# EAGLE schematic SchematicV1 (EAGLE 6.0)
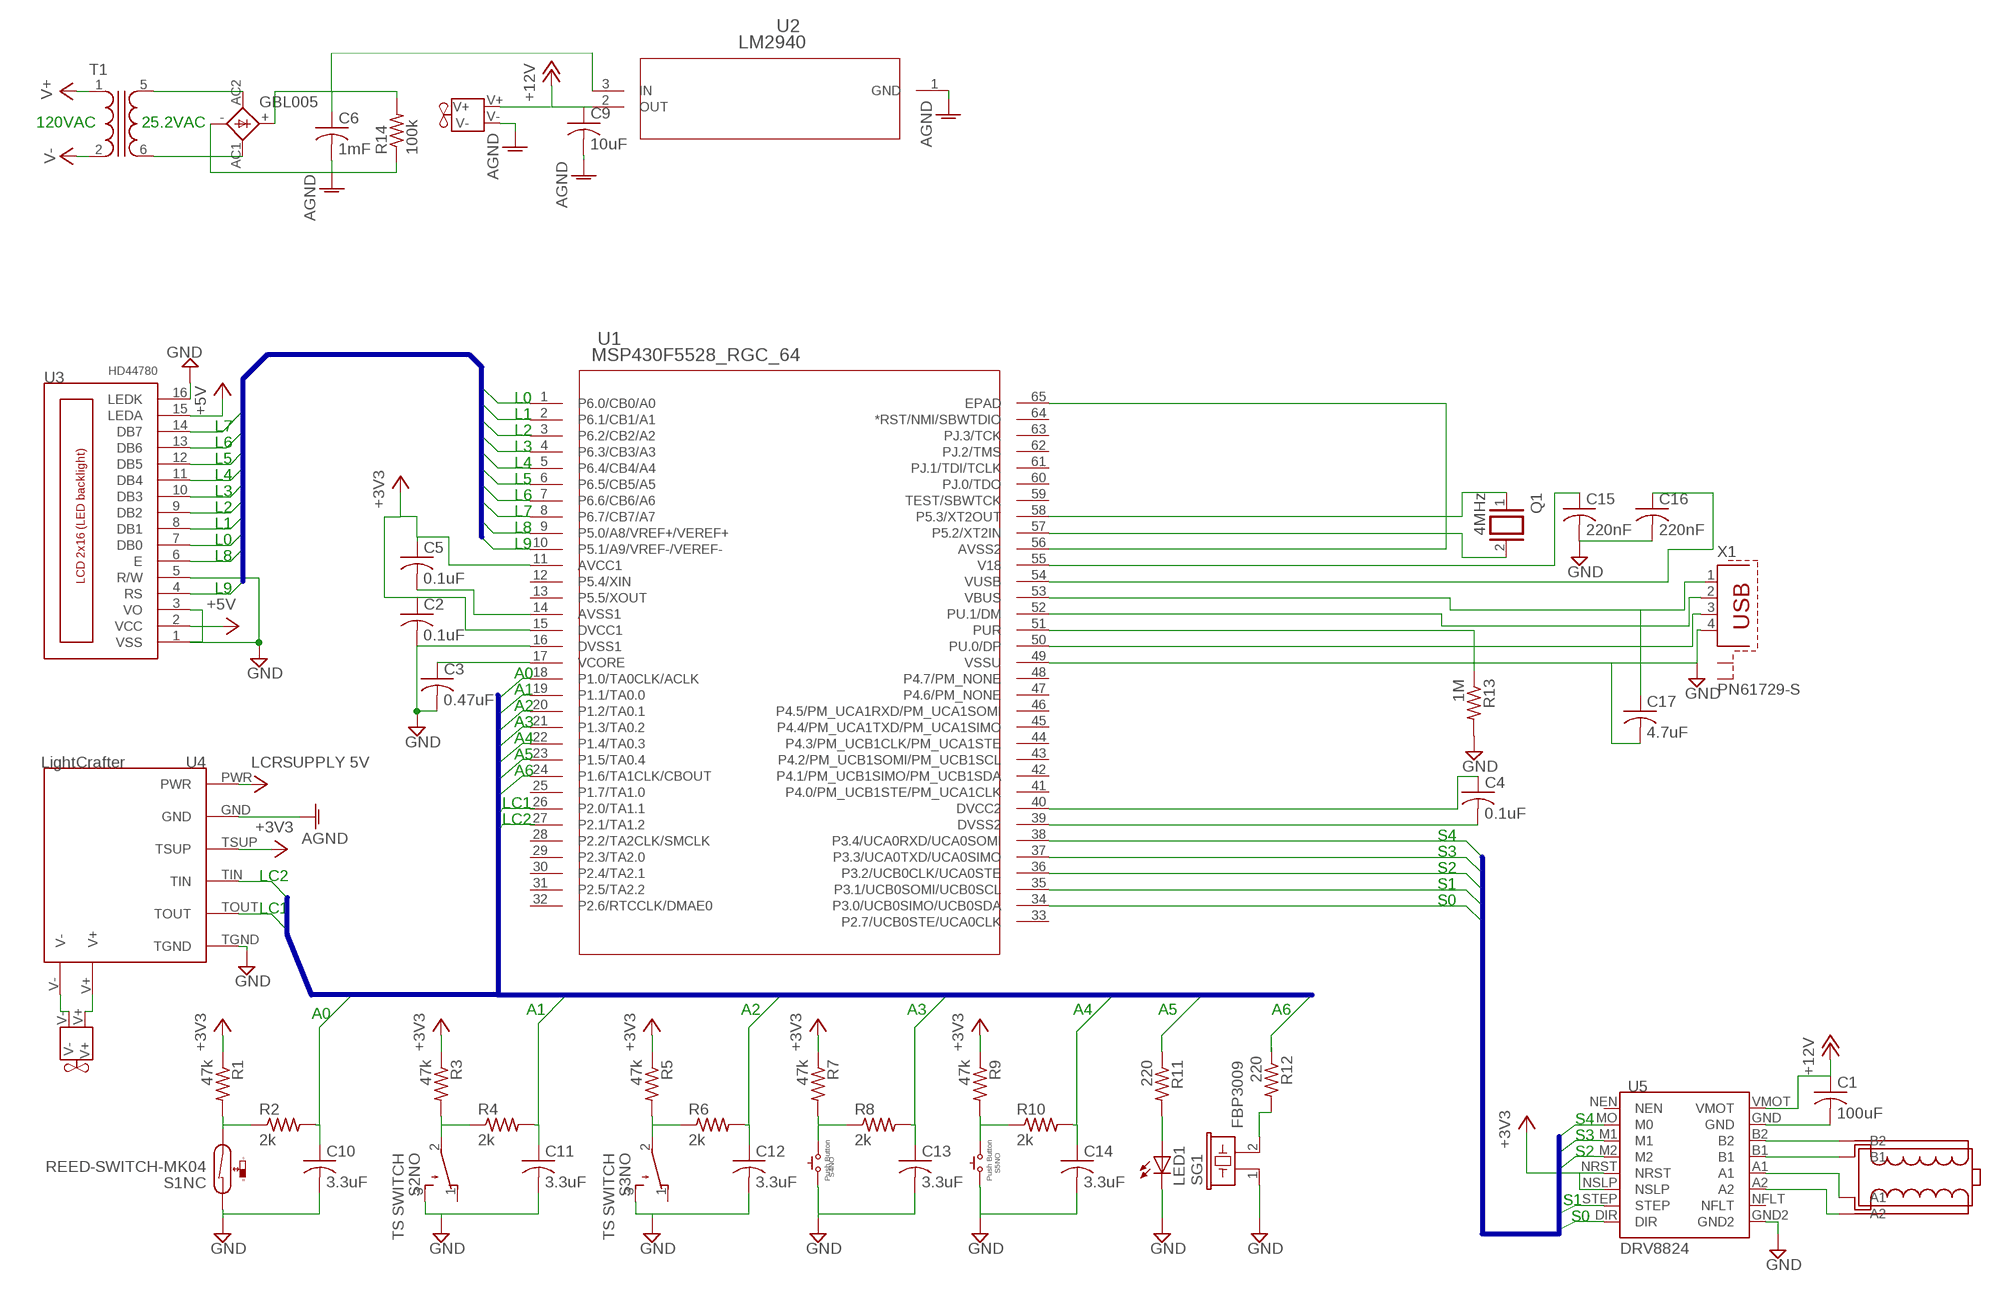
[diagram p0: schematic, sheet 1]

## Parts
C1  100uF  C-US075-032X103  [C075-032X103]
C2  0.1uF  C-US075-032X103  [C075-032X103]
C3  0.47uF  C-US075-032X103  [C075-032X103]
C4  0.1uF  C-US075-032X103  [C075-032X103]
C5  0.1uF  C-US075-032X103  [C075-032X103]
C6  1mF  C-US075-032X103  [C075-032X103]
C9  10uF  C-US075-032X103  [C075-032X103]
C10  3.3uF  C-US075-032X103  [C075-032X103]
C11  3.3uF  C-US075-032X103  [C075-032X103]
C12  3.3uF  C-US075-032X103  [C075-032X103]
C13  3.3uF  C-US075-032X103  [C075-032X103]
C14  3.3uF  C-US075-032X103  [C075-032X103]
C15  220nF  C-US075-032X103  [C075-032X103]
C16  220nF  C-US075-032X103  [C075-032X103]
C17  4.7uF  C-US075-032X103  [C075-032X103]
GBL005  GBU4  [GBU4S]
HD44780  LCD_2X16_SIL  [HY-1602F]
LED1  LEDB155  [Q62902-B155]
Q1  4MHz  XTAL/S  [QS]
R1  47k  R-US_0207/10  [0207/10]
R2  2k  R-US_0207/10  [0207/10]
R3  47k  R-US_0207/10  [0207/10]
R4  2k  R-US_0207/10  [0207/10]
R5  47k  R-US_0207/10  [0207/10]
R6  2k  R-US_0207/10  [0207/10]
R7  47k  R-US_0207/10  [0207/10]
R8  2k  R-US_0207/10  [0207/10]
R9  47k  R-US_0207/10  [0207/10]
R10  2k  R-US_0207/10  [0207/10]
R11  220  R-US_0207/10  [0207/10]
R12  220  R-US_0207/10  [0207/10]
R13  1M  R-US_0207/10  [0207/10]
R14  100k  R-US_0207/10  [0207/10]
S1NC  REED-SWITCH-MK04  REED-SWITCH-MK6-4  [MK6-4]
S2NO  TS SWITCH  TL32PO  [TL3XPO]
S3NO  TS SWITCH  TL32PO  [TL3XPO]
S4NO  PUSHBUTTON  [PUSHBUTTON]
S4NO1  PUSHBUTTON  [PUSHBUTTON]
SG1  FBP3009  B/C17S  [B/C17S]
T1  XFORMER  [T70-E]
U1  MSP430F5528_RGC_64  [RGC64_4P25X4P25]
U2  LM2940  LM1085_NDE_3  [T03B]
U3  DRV8824  [BO]
U$1  FAN  [FAN]
U$2  STEPPERMOTOR  [STEPPERMOTOR]
U$3  LIGHTCRAFTER  [LIGHTCRAFTER]
U$4  FAN  [FAN]
X1  PN61729-S  [PN61729-S]

## Nets
+3V3: C2.1 C5.1 R1.1 R3.1 R5.1 R7.1 R9.1 U1.11(AVCC1) U1.15(DVCC1) U$3.TSUP
+5V: HD44780.2(VCC) HD44780.15(LEDA)
+12V: C1.1 C9.1 U2.2(OUT) U3.VMOT
AGND: C6.2 C9.2 GBL005.- U2.1(GND) U$3.GND U$4.V-
GND: C2.2 C3.2 C10.2 C11.2 C12.2 C13.2 C14.2 C15.2 C16.2 C17.2 HD44780.1(VSS) HD44780.3(VO) HD44780.5(R/W) HD44780.16(LEDK) LED1.K(C) R13.2 S1NC.1 S2NO.3(S) S3NO.3(S) SG1.1 U1.16(DVSS1) U1.49(VSSU) U3.GND2 U$3.TGND X1.4
N$1: C1.2 U3.GND
N$2: U1.10(P5.1/A9/VREF-/VEREF-)
N$3: U1.9(P5.0/A8/VREF+/VEREF+)
N$4: C3.1 U1.17(VCORE)
N$5: C5.2 U1.14(AVSS1)
N$6: C4.1 U1.40(DVCC2)
N$7: U1.8(P6.7/CB7/A7)
N$8: U1.56(AVSS2) U1.65(EPAD)
N$9: C4.2 U1.39(DVSS2)
N$10: U1.38(P3.4/UCA0RXD/UCA0SOMI)
N$11: U1.37(P3.3/UCA0TXD/UCA0SIMO)
N$12: U1.36(P3.2/UCB0CLK/UCA0STE)
N$13: U1.35(P3.1/UCB0SOMI/UCB0SCL)
N$14: U1.34(P3.0/UCB0SIMO/UCB0SDA)
N$15: U3.MO(M0)
N$16: U3.M1
N$17: U3.M2
N$18: U3.STEP
N$19: U3.DIR
N$20: U3.NRST U3.NSLP ; supply symbol labelled +3V3
N$21: U3.B2 U$2.B2
N$22: U3.B1 U$2.B1
N$23: U3.A1 U$2.A1
N$24: U3.A2 U$2.A2
N$25: U1.7(P6.6/CB6/A6)
N$26: U1.6(P6.5/CB5/A5)
N$27: U1.5(P6.4/CB4/A4)
N$28: U1.4(P6.3/CB3/A3)
N$29: U1.3(P6.2/CB2/A2)
N$30: U1.2(P6.1/CB1/A1)
N$31: U1.1(P6.0/CB0/A0)
N$32: HD44780.14(DB7)
N$33: HD44780.13(DB6)
N$34: HD44780.12(DB5)
N$35: HD44780.11(DB4)
N$36: HD44780.10(DB3)
N$37: HD44780.9(DB2)
N$38: HD44780.8(DB1)
N$39: HD44780.7(DB0)
N$40: HD44780.6(E)
N$41: HD44780.4(RS)
N$42: GBL005.AC1(AC2) T1.6(S2)
N$43: GBL005.AC2(AC1) T1.5(S1)
N$44: U1.18(P1.0/TA0CLK/ACLK)
N$45: C6.1 GBL005.+ R14.2 U2.3(IN)
N$46: U1.19(P1.1/TA0.0)
N$47: U1.20(P1.2/TA0.1)
N$48: U1.21(P1.3/TA0.2)
N$49: U1.22(P1.4/TA0.3)
N$50: U1.23(P1.5/TA0.4)
N$51: U1.24(P1.6/TA1CLK/CBOUT)
N$54: U$3.TIN
N$55: U$3.TOUT
N$56: R1.2 R2.1 S1NC.2
N$57: C10.1 R2.2
N$58: R3.2 R4.1 S2NO.2(P)
N$59: C11.1 R4.2
N$60: R5.2 R6.1 S3NO.2(P)
N$61: C12.1 R6.2
N$62: R7.2 R8.1 S4NO.P$1
N$63: C13.1 R8.2
N$64: R9.2 R10.1 S4NO1.P$1
N$65: S4NO.P$2
N$66: C14.1 R10.2
N$67: S4NO1.P$2
N$68: R11.1
N$69: LED1.A R11.2
N$70: U1.53(VBUS) X1.1
N$71: R12.2 SG1.2
N$73: Q1.1 U1.58(P5.3/XT2OUT)
N$74: Q1.2 U1.57(P5.2/XT2IN)
N$75: U1.52(PU.1/DM) X1.2
N$76: U1.50(PU.0/DP) X1.3
N$77: C15.1 U1.55(V18)
N$78: R13.1 U1.51(PUR)
N$79: U$1.V- U$3.V-
N$80: U$1.V+ U$3.V+
N$81: U$4.V+
N$82: C16.1 U1.54(VUSB)
N$83: R14.1
V+: T1.1
V-: T1.2
VCC: U$3.PWR ; supply symbol labelled LCRSUPPLY 5V
Unconnected: C17.1 R12.1 S2NO.1(O) S3NO.1(O) T1.3(P1) T1.4(P2) T1.7(S1) T1.8(S2) U1.12(P5.4/XIN) U1.13(P5.5/XOUT) U1.25(P1.7/TA1.0) U1.26(P2.0/TA1.1) U1.27(P2.1/TA1.2) U1.28(P2.2/TA2CLK/SMCLK) U1.29(P2.3/TA2.0) U1.30(P2.4/TA2.1) U1.31(P2.5/TA2.2) U1.32(P2.6/RTCCLK/DMAE0) U1.33(P2.7/UCB0STE/UCA0CLK) U1.41(P4.0/PM_UCB1STE/PM_UCA1CLK) U1.42(P4.1/PM_UCB1SIMO/PM_UCB1SDA) U1.43(P4.2/PM_UCB1SOMI/PM_UCB1SCL) U1.44(P4.3/PM_UCB1CLK/PM_UCA1STE) U1.45(P4.4/PM_UCA1TXD/PM_UCA1SIMO) U1.46(P4.5/PM_UCA1RXD/PM_UCA1SOMI) U1.47(P4.6/PM_NONE) U1.48(P4.7/PM_NONE) U1.59(TEST/SBWTCK) U1.60(PJ.0/TDO) U1.61(PJ.1/TDI/TCLK) U1.62(PJ.2/TMS) U1.63(PJ.3/TCK) U1.64(*RST/NMI/SBWTDIO) U3.NEN U3.NFLT X1.S1 X1.S2

## Buses
B$1
B$2
B$3

## Notes on the sheet
- 120VAC | 25.2VAC
- U3
- L0
- L1
- L7 | L2
- L6 | L3
- L5 | L4
- L4 | L5
- L3 | L6
- L2 | L7
- L1 | L8
- L0 | L9
- L8
- L9
- A0
- A1
- A2
- A3
- A4
- A5
- U4
- A6
- LC1
- LC2
- S4
- S3
- S2
- LC2
- S1
- S0
- LC1
- A0 | A1 | A2 | A3 | A4 | A5 | A6
- U5
- S4
- S3
- S2
- S5NO
- S4NO
- S1
- S0
- DRV8824

## Library data of the parts
C1-C6 C9-C17 = rcl:C-US: CAPACITOR, American symbol
GBL005 = rectifier:GBU4: GENERAL INSTRUMENT RECTIFIER
HD44780 = lcd_2x16_led_backlight:LCD_2X16_SIL
LED1 = led:LED: LED OSRAM: - CHIPLED LG R971, LG N971, LY N971, LG Q971, LY Q971, LO R971, LY R971 LH N974, LH R974 LS Q976, LO Q976, LY Q976 LO Q996 - Hyper CHIPLED LW Q18S LB Q993, LB Q99A, LB R99A - SideLED LS A670, LO A670, LY A670, LG A670, LP A670 LB A673, LV A673, LT A673, LW A673 LH A674 LY A675 LS A676, LA A676, LO A676, LY A676, LW A676 LS A679, LY A679, LG A679 - Hyper Micro SIDELED® LS Y876, LA Y876, LO Y876, LY Y876 LT Y87S - SmartLED LW L88C, LW L88S LB L89C, LB L89S, LG L890 LS L89K, LO L89K, LY L89K LS L896, LA L896, LO L896, LY L896 - TOPLED LS T670, LO T670, LY T670, LG T670, LP T670 LSG T670, LSP T670, LSY T670, LOP T670, LYG T670 LG T671, LOG T671, LSG T671 LB T673, LV T673, LT T673, LW T673 LH T674 LS T676, LA T676, LO T676, LY T676, LB T676, LH T676, LSB T676, LW T676 LB T67C, LV T67C, LT T67C, LS T67K, LO T67K, LY T67K, LW E67C LS E67B, LA E67B, LO E67B, LY E67B, LB E67C, LV E67C, LT E67C LW T67C LS T679, LY T679, LG T679 LS T770, LO T770, LY T770, LG T770, LP T770 LB T773, LV T773, LT T773, LW T773 LH T774 LS E675, LA E675, LY E675, LS T675 LS T776, LA T776, LO T776, LY T776, LB T776 LHGB T686 LT T68C, LB T68C - Hyper Mini TOPLED® LB M676 - Mini TOPLED Santana® LG M470 LS M47K, LO M47K, LY M47K Source: http://www.osram.convergy.de LUXEON: - LUMILED® LXK2-PW12-R00, LXK2-PW12-S00, LXK2-PW14-U00, LXK2-PW14-V00 LXK2-PM12-R00, LXK2-PM12-S00, LXK2-PM14-U00 LXK2-PE12-Q00, LXK2-PE12-R00, LXK2-PE12-S00, LXK2-PE14-T00, LXK2-PE14-U00 LXK2-PB12-K00, LXK2-PB12-L00, LXK2-PB12-M00, LXK2-PB14-N00, LXK2-PB14-P00, LXK2-PB14-Q00 LXK2-PR12-L00, LXK2-PR12-M00, LXK2-PR14-Q00, LXK2-PR14-R00 LXK2-PD12-Q00, LXK2-PD12-R00, LXK2-PD12-S00 LXK2-PH12-R00, LXK2-PH12-S00 LXK2-PL12-P00, LXK2-PL12-Q00, LXK2-PL12-R00 Source: www.luxeon.com KINGBRIGHT: KA-3528ASYC Source: www.kingbright.com
Q1 = special:XTAL/S: CRYSTAL
R1-R14 = rcl:R-US_: RESISTOR, American symbol
S1NC = switch-reed:REED-SWITCH-: Reed Sensor; OC_FARNELL: unknown
S2NO S3NO = switch:TL32PO: TINY SWITCH ON - MOM Source: http://www2.produktinfo.conrad.com/datenblaetter/700000-724999/705152-da-01-de-Subminiaturschalter_TL_36YO.pdf
S4NO S4NO1 = PUSHBUTTON:PUSHBUTTON
SG1 = buzzer:B/C17S: BUZZER Source: Buerklin; OC_FARNELL: unknown; OC_NEWARK: unknown
T1 = special:XFORMER: TRANSFORMER 2 x primary, 2 x secondary
U1 = MSP430F5528QFN64:MSP430F5528_RGC_64; DATASHEETURL: http://www.ti.com/lit/gpn/MSP430F5528; DESCRIPTION: 16-Bit Ultra-Low-Power Microcontroller, 128KB Flash, 8KB RAM, USB, 12Bit ADC, 2 USCIs, 32Bit HW MPY; FAMILY_NAME: 5 Series; GENERIC_PART_NUMBER: MSP430F5528; INDUSTRY_STD_PKG_TYPE: VQFN; MANUFACTURER: Texas Instruments; MANUFACTURER_PART_NUMBER: msp430f5528_rgc_64; PACKAGE_DESIGNATOR: RGC; PIN_COUNT: 64; VENDOR: Texas Instruments
U2 = LM1085:LM1085_NDE_3; BASE_PN: LM1085; COMP: TypeLDO; LIBRARY: ReferenceLM1085IT; PARTNUMBER: LM1085IT-12; PIN: Count3; SYMBOL: NameLM1085IT-12; TYPE: LM1085IT-12; VENDOR: NationalSemiconductor; VERSION: 1
U3 = DRV8824B0:DRV8824
U$1 U$4 = FAN:FAN
U$2 = STEPPERMOTOR:STEPPERMOTOR
U$3 = Lightcrafter:LIGHTCRAFTER
X1 = con-berg:PN61729-S: BERG USB connector; OC_FARNELL: unknown; OC_NEWARK: unknown